# Altium schematic sheet Sensors.SchDoc
size Legal; Date: Feb 11, 2024; CompanyName: SINEBOTICS; DrawnBy: Tharnath Bagirathan; SheetNumber: 3; SheetTotal: 3
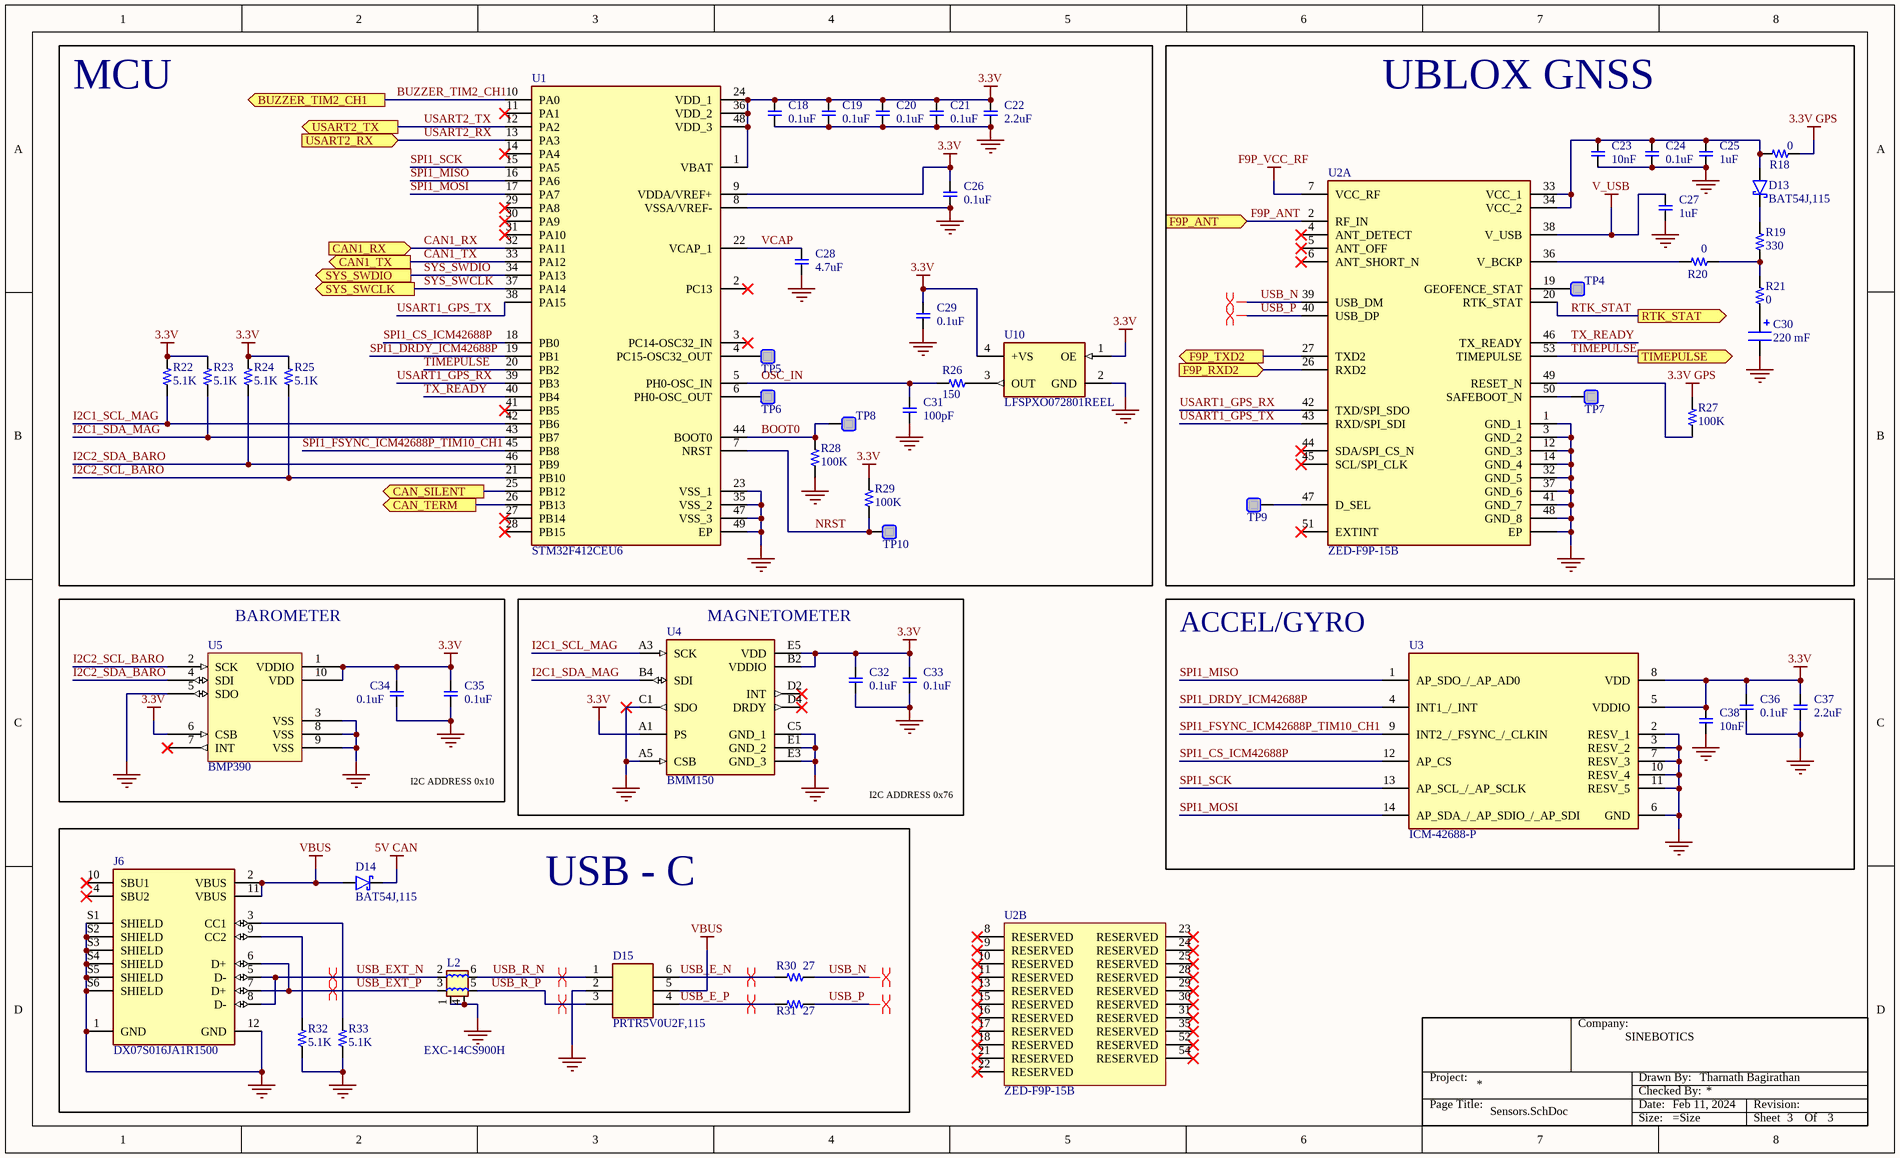
[diagram p0: Sensors.SchDoc]

## Parts
C18  0.1uF  [C0402]
C19  0.1uF  [C0402]
C20  0.1uF  [C0402]
C21  0.1uF  [C0402]
C22  2.2uF  [C0402]
C23  10nF  [C0402]
C24  0.1uF  [C0402]
C25  1uF  [C0402]
C26  0.1uF  [C0402]
C27  1uF  [C0402]
C28  4.7uF  [C0402]
C29  0.1uF  [C0402]
C30  220 mF  [DSK3R3H334THL]
C31  100pF  [C0402]
C32  0.1uF  [C0402]
C33  0.1uF  [C0402]
C34  0.1uF  [C0402]
C35  0.1uF  [C0402]
C36  0.1uF  [C0402]
C37  2.2uF  [C0402]
C38  10nF  [C0402]
D13  BAT54J,115  [SODFL2512X80N]
D14  BAT54J,115  [SODFL2512X80N]
D15  PRTR5V0U2F,115  [PESD3V3L5UF115]
J6  DX07S016JA1R1500  [JAE_DX07S016JA1R1500]
L2  EXC-14CS900H  [EXC14CS900H]
R18  0  [R0402]
R19  330  [R0402]
R20  0  [R0402]
R21  0  [R0402]
R22  5.1K  [R0402]
R23  5.1K  [R0402]
R24  5.1K  [R0402]
R25  5.1K  [R0402]
R26  150  [R0402]
R27  100K  [R0402]
R28  100K  [R0402]
R29  100K  [R0402]
R30  27  [R0402]
R31  27  [R0402]
R32  5.1K  [R0402]
R33  5.1K  [R0402]
TitleBlock  TitleBlock  (value not drawn)  (graphical)
TP4  TestPad  [TestPad]  (value not drawn)  (no BOM)
TP5  TestPad  [TestPad]  (value not drawn)  (no BOM)
TP6  TestPad  [TestPad]  (value not drawn)  (no BOM)
TP7  TestPad  [TestPad]  (value not drawn)  (no BOM)
TP8  TestPad  [TestPad]  (value not drawn)  (no BOM)
TP9  TestPad  [TestPad]  (value not drawn)  (no BOM)
TP10  TestPad  [TestPad]  (value not drawn)  (no BOM)
U1  STM32F412CEU6  [QFN50P700X700X65-49N-D]
U2  ZED-F9P-15B  [ZEDF9P15B]  (parts A,B of 2)
U3  ICM-42688-P  [IIM42352]
U4  BMM150  [BMM150]
U5  BMP390  [BMP390]
U10  LFSPXO072801REEL  [LFSPXO072801REEL]

## Blocks framed on the sheet
MCU: C18-C22 C26 C28 C29 C31 R22-R26 R28 R29 TP5 TP6 TP8 TP10 U1 U10
UBLOX GNSS: C23-C25 C27 C30 D13 R18-R21 R27 TP4 TP7 TP9 U2
BAROMETER: C34 C35 U5
MAGNETOMETER: C32 C33 U4
ACCEL/GYRO: C36-C38 U3
USB - C: D14 D15 J6 L2 R30-R33

## Ports
BUZZER_TIM2_CH1 (out, see Power[3C]), CAN1_RX (in, see Power[1A]), CAN1_TX (out, see Power[1A]), CAN_SILENT (out, see Power[1B]), CAN_TERM (out, see Power[2B]), F9P_ANT (in, see Power[3B]), F9P_RXD2 (in, see Power[2B]), F9P_TXD2 (out, see Power[2B]), RTK_STAT (out, see Power[4C]), SYS_SWCLK (out, see Power[1D]), SYS_SWDIO (out, see Power[1D]), TIMEPULSE (out, see Power[3C]), USART2_RX (in, see Power[1D]), USART2_TX (out, see Power[1D])

## Nets
3.3V: C18.2 C19.2 C20.2 C21.2 C22.2 C26.2 C29.2 C32.2 C33.2 C34.2 C35.2 C36.2 C37.2 C38.2 R22.2 R23.2 R24.2 R25.2 R29.2 U1.1(VBAT) U1.9(VDDA/VREF+) U1.24(VDD_1) U1.36(VDD_2) U1.48(VDD_3) U3.5(VDDIO) U3.8(VDD) U4.A1(PS) U4.B2(VDDIO) U4.E5(VDD) U5.1(VDDIO) U5.6(CSB) U5.10(VDD) U10.1(OE) U10.4(+VS)
3.3V GPS: R18.2 R27.2
5V CAN: D14.1(K)
F9P_VCC_RF: U2.7(VCC_RF)
GND: C18.1 C19.1 C20.1 C21.1 C22.1 C23.1 C24.1 C25.1 C26.1 C27.1 C28.1 C29.1 C30.2(-) C31.1 C32.1 C33.1 C34.1 C35.1 C36.1 C37.1 C38.1 D15.2(ground) J6.1(GND) J6.12(GND) J6.S1(SHIELD) J6.S2(SHIELD) J6.S3(SHIELD) J6.S4(SHIELD) J6.S5(SHIELD) J6.S6(SHIELD) L2.1(GND_1) L2.4(GND_2) R28.1 R32.1 R33.1 U1.8(VSSA/VREF-) U1.23(VSS_1) U1.35(VSS_2) U1.47(VSS_3) U1.49(EP) U2.1(GND_1) U2.3(GND_2) U2.12(GND_3) U2.14(GND_4) U2.32(GND_5) U2.37(GND_6) U2.41(GND_7) U2.48(GND_8) U2.55(EP) U3.2(RESV_1) U3.3(RESV_2) U3.6(GND) U3.7(RESV_3) U3.10(RESV_4) U3.11(RESV_5) U4.A5(CSB) U4.C1(SDO) U4.C5(GND_1) U4.E1(GND_2) U4.E3(GND_3) U5.3(VSS) U5.5(SDO) U5.8(VSS) U5.9(VSS) U10.2(GND)
V_USB: C27.2 U2.38(V_USB)
VBUS: D14.2(A) D15.5(supply_voltage) J6.2(VBUS) J6.11(VBUS)
BOOT0: R28.2 TP8.1 U1.44(BOOT0)
BUZZER_TIM2_CH1: U1.10(PA0) ; port BUZZER_TIM2_CH1
CAN1_RX: U1.32(PA11) ; port CAN1_RX
CAN1_TX: U1.33(PA12) ; port CAN1_TX
CAN_SILENT: U1.25(PB12) ; port CAN_SILENT
CAN_TERM: U1.26(PB13) ; port CAN_TERM
F9P_ANT: U2.2(RF_IN) ; port F9P_ANT
F9P_RXD2: U2.26(RXD2) ; port F9P_RXD2
F9P_TXD2: U2.27(TXD2) ; port F9P_TXD2
I2C1_SCL_MAG: R22.1 U1.42(PB6) U4.A3(SCK)
I2C1_SDA_MAG: R23.1 U1.43(PB7) U4.B4(SDI)
I2C2_SCL_BARO: R25.1 U1.21(PB10) U5.2(SCK)
I2C2_SDA_BARO: R24.1 U1.46(PB9) U5.4(SDI)
NRST: R29.1 TP10.1 U1.7(NRST)
OSC_IN: C31.2 R26.2 U1.5(PH0-OSC_IN)
RTK_STAT: U2.20(RTK_STAT) ; port RTK_STAT
SPI1_CS_ICM42688P: U1.18(PB0) U3.12(AP_CS)
SPI1_DRDY_ICM42688P: U1.19(PB1) U3.4(INT1_/_INT)
SPI1_FSYNC_ICM42688P_TIM10_CH1: U1.45(PB8) U3.9(INT2_/_FSYNC_/_CLKIN)
SPI1_MISO: U1.16(PA6) U3.1(AP_SDO_/_AP_AD0)
SPI1_MOSI: U1.17(PA7) U3.14(AP_SDA_/_AP_SDIO_/_AP_SDI)
SPI1_SCK: U1.15(PA5) U3.13(AP_SCL_/_AP_SCLK)
SYS_SWCLK: U1.37(PA14) ; port SYS_SWCLK
SYS_SWDIO: U1.34(PA13) ; port SYS_SWDIO
TIMEPULSE: U1.20(PB2) U2.53(TIMEPULSE) ; port TIMEPULSE
TX_READY: U1.40(PB4) U2.46(TX_READY)
USART1_GPS_RX: U1.39(PB3) U2.42(TXD/SPI_SDO)
USART1_GPS_TX: U1.38(PA15) U2.43(RXD/SPI_SDI)
USART2_RX: U1.13(PA3) ; port USART2_RX
USART2_TX: U1.12(PA2) ; port USART2_TX
USB_E_N: D15.6(input/output_1_2) R30.1
USB_E_P: D15.4(input/output_2_2) R31.2
USB_EXT_N: J6.5(D-) J6.8(D-) L2.2(COIL_1)
USB_EXT_P: J6.6(D+) J6.7(D+) L2.3(COIL_2)
USB_N: R30.2 U2.39(USB_DM)
USB_P: R31.1 U2.40(USB_DP)
USB_R_N: D15.1(input/output_1_1) L2.6(COIL_4)
USB_R_P: D15.3(input/output_2_1) L2.5(COIL_3)
VCAP: C28.2 U1.22(VCAP_1)
NetC23_2: C23.2 C24.2 C25.2 D13.2(A) R18.1 U2.33(VCC_1) U2.34(VCC_2)
NetC30_1: C30.1(+) R21.1
NetD13_1: D13.1(K) R19.2
NetJ6_3: J6.3(CC1) R33.2
NetJ6_9: J6.9(CC2) R32.2
NetR19_1: R19.1 R20.2 R21.2
NetR20_1: R20.1 U2.36(V_BCKP)
NetR26_1: R26.1 U10.3(OUT)
NetR27_1: R27.1 U2.49(RESET_N)
NetTP4_1: TP4.1 U2.19(GEOFENCE_STAT)
NetTP5_1: TP5.1 U1.4(PC15-OSC32_OUT)
NetTP6_1: TP6.1 U1.6(PH0-OSC_OUT)
NetTP7_1: TP7.1 U2.50(SAFEBOOT_N)
NetTP9_1: TP9.1 U2.47(D_SEL)

Not connected (* = marked no-connect by the designer): J6 4(SBU2)* 10(SBU1)*; U1 2(PC13)* 3(PC14-OSC32_IN)* 11(PA1)* 14(PA4)* 27(PB14)* 28(PB15)* 29(PA8)* 30(PA9)* 31(PA10)* 41(PB5)*; U2 4(ANT_DETECT)* 5(ANT_OFF)* 6(ANT_SHORT_N)* 8(RESERVED)* 9(RESERVED)* 10(RESERVED)* 11(RESERVED)* 13(RESERVED)* 15(RESERVED)* 16(RESERVED)* 17(RESERVED)* 18(RESERVED)* 21(RESERVED)* 22(RESERVED)* 23(RESERVED)* 24(RESERVED)* 25(RESERVED)* 28(RESERVED)* 29(RESERVED)* 30(RESERVED)* 31(RESERVED)* 35(RESERVED)* 44(SDA/SPI_CS_N)* 45(SCL/SPI_CLK)* 51(EXTINT)* 52(RESERVED)* 54(RESERVED)*; U4 D2(INT)* D4(DRDY)*; U5 7(INT)*

## Layout directives
differential pair: USB_E_N, USB_E_P, USB_EXT_N, USB_EXT_P, USB_N, USB_P, USB_R_N, USB_R_P

## Notes on the sheet
- I2C ADDRESS 0x10
- I2C ADDRESS 0x76
- (in symbol TitleBlock) Company:; Project:; Drawn By:; Checked By:; Page Title:; Date:; Revision:; Size:; Sheet        Of

## Library data of the parts
C18-C21 C24 C26 C29 C32-C36 = CAP_0402: Capacitor 0402 Generic; Manufacturer Part Number: 0402X104K250CT; Manufacturer: Walsin Technology Corporation; Manufacturer Part Description: CAP CER 0.1uF ±10% 25V X5R 0402 (1005 Metric)
C22 C37 = CAP_0402: Capacitor 0402 Generic; Manufacturer Part Number: GRM155R61A225ME95D; Manufacturer: Murata; Manufacturer Part Description: CAP CER 2.2uF ±20% 10V X5R 0402 (1005 Metric)
C23 C38 = CAP_0402: Capacitor 0402 Generic; Manufacturer Part Number: CL05B103KA5NNNC; Manufacturer: Samsung; Manufacturer Part Description: CAP CER 10000pF ±10% 25V X7R 0402 (1005 Metric)
C25 C27 = CAP_0402: Capacitor 0402 Generic; Manufacturer Part Number: CL05A105KP5NNNC; Manufacturer: Samsung Electro-Mechanics; Manufacturer Part Description: CAP CER 1uF ±10% 10V X5R 0402 (1005 Metric)
C28 = CAP_0402: Capacitor 0402 Generic; Manufacturer Part Number: C1005X5R0J475K050BC; Manufacturer: TDK Corporation; Manufacturer Part Description: CAP CER 4.7uF ±10% 6.3V X5R 0402 (1005 Metric)
C30 = DSK-3R3H224U-HL: Capacitor Polarised; Manufacturer Name: Elna; Datasheet Link: https://componentsearchengine.com/Datasheets/1/DSK-3R3H224U-HL.pdf; Height: 3mm; Mouser Price/Stock: https://www.mouser.co.uk/ProductDetail/Elna/DSK-3R3H224U-HL?qs=QQsyD2Kvh2ftLwsh6FwcaA%3D%3D; Manufacturer Part Number: DSK-3R3H224U-HL
C31 = CAP_0402: Capacitor 0402 Generic; Manufacturer Part Number: CL05C101JB5NNNC; Manufacturer: Samsung Electro-Mechanics; Manufacturer Part Description: CAP CER 100pF ±5% 50V NPO 0402 (1005 Metric)
D13 D14 = BAT54J,115: Schottky Diode; Manufacturer Name: Nexperia; Datasheet Link: https://assets.nexperia.com/documents/data-sheet/BAT54J.pdf; Height: 0.8mm; Mouser Price/Stock: https://www.mouser.co.uk/ProductDetail/Nexperia/BAT54J115?qs=me8TqzrmIYVxNBNrx1zKWQ%3D%3D; Arrow Part Number: BAT54J,115; Arrow Price/Stock: https://www.arrow.com/en/products/bat54j115/nexperia?region=europe; Manufacturer Part Number: BAT54J,115
D15 = PRTR5V0U2F,115: Diode; Manufacturer Name: Nexperia; Datasheet Link: https://assets.nexperia.com/documents/data-sheet/PRTR5V0U2F_PRTR5V0U2K.pdf; Height: 0.5mm; Manufacturer_Part_Number: PRTR5V0U2F,115; Mouser Price/Stock: https://www.mouser.co.uk/ProductDetail/Nexperia/PRTR5V0U2F115?qs=LOCUfHb8d9uDeQFPTHx5Dg%3D%3D; Arrow Part Number: PRTR5V0U2F,115; Arrow Price/Stock: https://www.arrow.com/en/products/prtr5v0u2f115/nexperia?region=europe; Manufacturer Part Number: PRTR5V0U2F,115
J6 = DX07S016JA1R1500: USB-C (USB TYPE-C) USB 2.0 Receptacle Connector 24 (16+8 Dummy) Position Surface Mount, Right Angle; Through Hole; Manufacturer Name: JAE Electronics; Package: None; Price: None; Manufacturer Part Number: DX07S016JA1R1500
L2 = EXC-14CS900H: Filter; Manufacturer Name: Panasonic; Datasheet Link: http://www.mouser.com/datasheet/2/315/AWE0000C291-1283916.pdf; Height: 0.5mm; Mouser Price/Stock: https://www.mouser.co.uk/ProductDetail/Panasonic/EXC-14CS900H?qs=f9yNj16SXrIzBMQRKJh4tA%3D%3D; Arrow Part Number: EXC-14CS900H; Arrow Price/Stock: https://www.arrow.com/en/products/exc-14cs900h/panasonic?region=nac; Manufacturer Part Number: EXC-14CS900H
R18 R20 R21 = RES_0402: Resistor 0402 Generic; Manufacturer: Yageo; Manufacturer Part Number: AC0402JR-070RL; Manufacturer Part Description: RES 0 Ohm Jumper 1/16W 0402 (1005 Metric)
R19 = RES_0402: Resistor 0402 Generic; Manufacturer: Yageo; Manufacturer Part Number: RC0402FR-07330RL; Manufacturer Part Description: RES 330 Ohm ±1% 1/16W 0402 (1005 Metric)
R22-R25 R32 R33 = RES_0402: Resistor 0402 Generic; Manufacturer: Yageo; Manufacturer Part Number: RC0402FR-075K1L; Manufacturer Part Description: RES 5.1K Ohm ±1% 1/16W 0402 (1005 Metric)
R26 = RES_0402: Resistor 0402 Generic; Manufacturer: Stackpole Electronics Inc; Manufacturer Part Number: RC0402FR-07150RL; Manufacturer Part Description: RES 150 Ohm ±1% 1/16W 0402 (1005 Metric)
R27-R29 = RES_0402: Resistor 0402 Generic; Manufacturer: Yageo; Manufacturer Part Number: AC0402JR-07100KL; Manufacturer Part Description: RES 100K Ohm ±5% 1/16W 0402 (1005 Metric)
R30 R31 = RES_0402: Resistor 0402 Generic; Manufacturer: Yageo; Manufacturer Part Number: AC0402FR-0727RL; Manufacturer Part Description: RES 27 Ohm ±1% 1/16W 0402 (1005 Metric)
TitleBlock = TitleBlock: TitleBlock For Schematics
TP4-TP10 = TestPad: Test Pads
U1 = STM32F412CEU6: ARM Microcontrollers - MCU 16/32-BITS MICROS; Manufacturer Name: STMicroelectronics; Geometry.Height: 0.65mm; Mouser Price/Stock: https://www.mouser.co.uk/ProductDetail/STMicroelectronics/STM32F412CEU6?qs=xwQlLnDx56BQrVh57SaY3Q%3D%3D; Datasheet Link: https://www.st.com/resource/en/datasheet/stm32f412ve.pdf; Manufacturer Part Number: STM32F412CEU6
U2 = ZED-F9P-15B: Ublox F9P-15B Dual Band GNSS Receiver; pin to pad: 55>55+56+57+58+59+60+61+62+63+64+65+66+67+68+69+70+71+72+73+74+75+76+77+78+79+80+81+82+83+84+85+86+87+88+89+90+91+92+93+94+95+96+97+98+99+100+101+102; Manufacturer Name: U-Blox; Datasheet Link: https://content.u-blox.com/sites/default/files/documents/ZED-F9P-15B_DataSheet_UBX-23009090.pdf; Height: 2.6mm; Manufacturer Part Number: ZED-F9P-15B
U3 = ICM-42688-P: Integrated Circuit; Manufacturer Name: TDK; Datasheet Link: https://3cfeqx1hf82y3xcoull08ihx-wpengine.netdna-ssl.com/wp-content/uploads/2021/06/DS-000347-ICM-42688-P-v1.5.pdf; Mouser Price/Stock: https://www.mouser.co.uk/ProductDetail/TDK-InvenSense/ICM-42688-P?qs=OlC7AqGiEDk8QrNAV728zw%3D%3D; Arrow Part Number: ICM-42688-P; Arrow Price/Stock: https://www.arrow.com/en/products/icm-42688-p/invensense?region=nac; Manufacturer Part Number: ICM-42688-P
U4 = BMM150: Integrated Circuit; Manufacturer Name: BOSCH; Datasheet Link: https://www.arrow.com/en/products/bmm150/bosch; Height: 0.6mm; Mouser Price/Stock: https://www.mouser.co.uk/ProductDetail/Bosch-Sensortec/BMM150?qs=d72FGnIDsgTOmKpCEe6mYw%3D%3D; Arrow Part Number: BMM150; Arrow Price/Stock: https://www.arrow.com/en/products/bmm150/bosch?region=nac; Manufacturer Part Number: BMM150
U5 = BMP390: Bosch Sensortec BMP390 Barometer; Manufacturer: Bosch Sensortec; Manufacturer Part Number: BMP390
U10 = LFSPXO072801REEL: Crystal or Oscillator; Manufacturer Name: IQD; Datasheet Link: https://eu.mouser.com/datasheet/2/741/LFSPXO072801Reel-1543851.pdf; Height: 1mm; Mouser Price/Stock: https://www.mouser.co.uk/ProductDetail/IQD/LFSPXO072801Reel?qs=HXFqYaX1Q2yCGu0eBJbHng%3D%3D; Arrow Part Number: LFSPXO072801REEL; Arrow Price/Stock: https://www.arrow.com/en/products/lfspxo072801reel/iqd-frequency-products?region=nac; Manufacturer Part Number: LFSPXO072801REEL